# Altium project H-00488.PrjPcb (part 2 of 2)

## Sheet H-00488 - USB Hub.SchDoc: 7-Port USB Hub (USB2517)
size 403 x 281 mm; DocumentNumber: 7; SheetNumber: 7; SheetTotal: 12
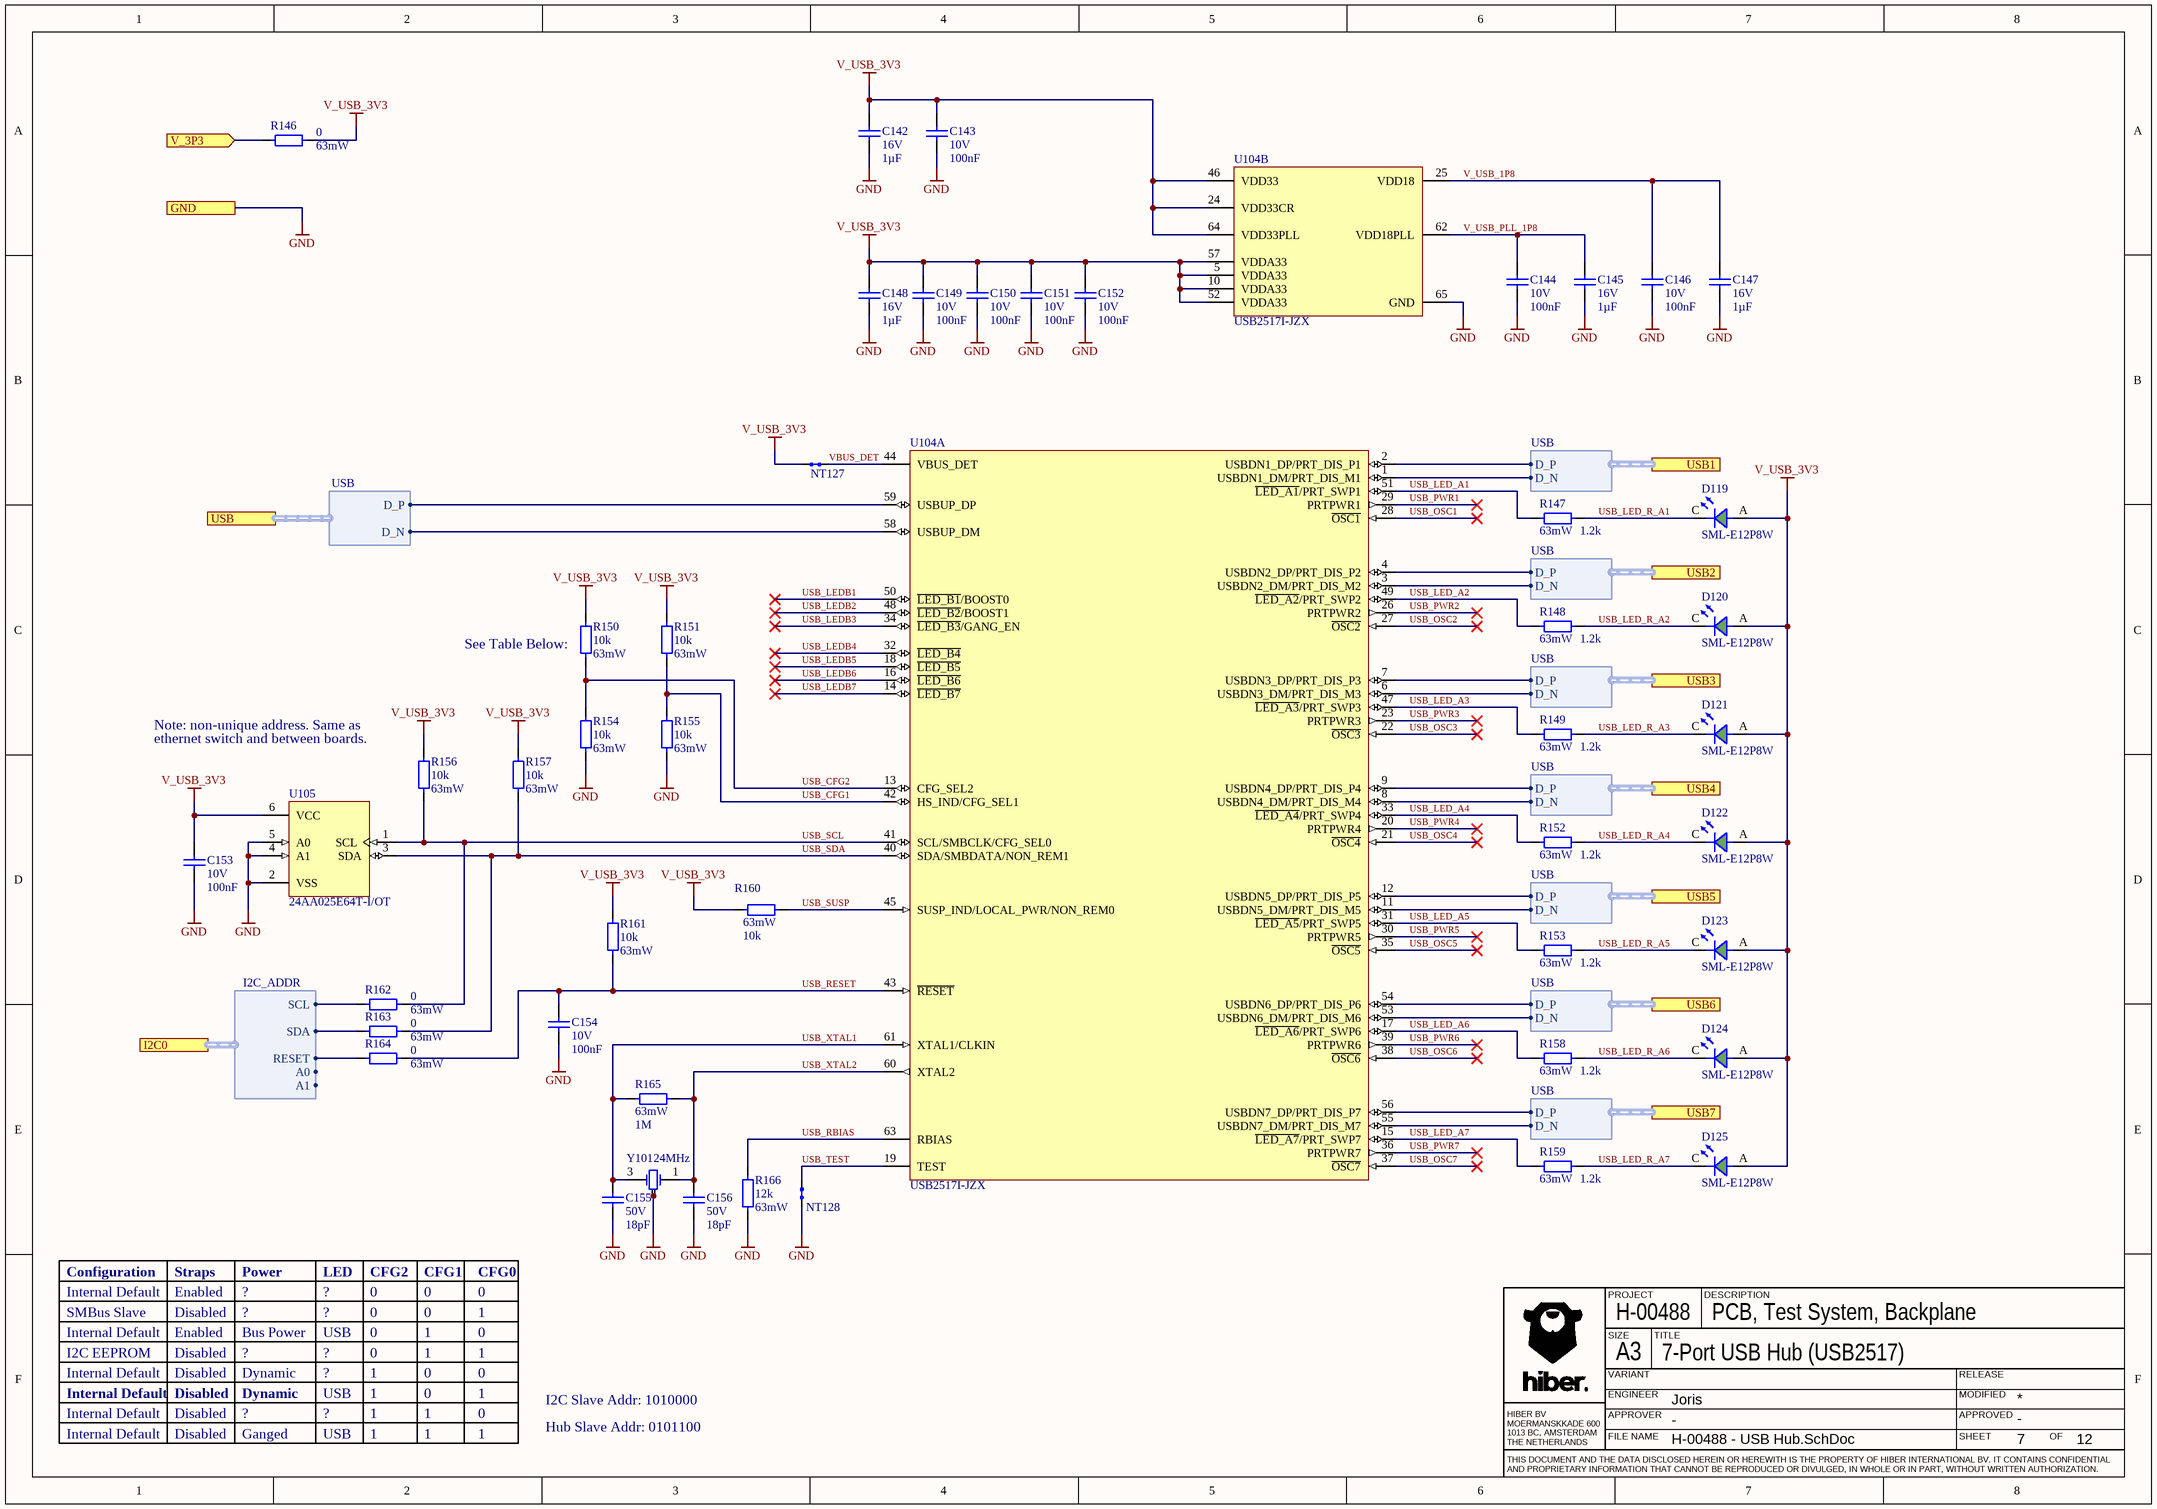
[diagram p4: H-00488 - USB Hub.SchDoc]

### Parts
C142  value 1µF  Rated Voltage: 16V  [CAPC100X50X55L30N]  (hidden comment: C0402C105K4PACTU)
C143  value 100nF  Rated Voltage: 10V  [CAPC100X50X55L30N]  (hidden comment: C0402C104K8RACTU)
C144  value 100nF  Rated Voltage: 10V  [CAPC100X50X55L30N]  (hidden comment: C0402C104K8RACTU)
C145  value 1µF  Rated Voltage: 16V  [CAPC100X50X55L30N]  (hidden comment: C0402C105K4PACTU)
C146  value 100nF  Rated Voltage: 10V  [CAPC100X50X55L30N]  (hidden comment: C0402C104K8RACTU)
C147  value 1µF  Rated Voltage: 16V  [CAPC100X50X55L30N]  (hidden comment: C0402C105K4PACTU)
C148  value 1µF  Rated Voltage: 16V  [CAPC100X50X55L30N]  (hidden comment: C0402C105K4PACTU)
C149  value 100nF  Rated Voltage: 10V  [CAPC100X50X55L30N]  (hidden comment: C0402C104K8RACTU)
C150  value 100nF  Rated Voltage: 10V  [CAPC100X50X55L30N]  (hidden comment: C0402C104K8RACTU)
C151  value 100nF  Rated Voltage: 10V  [CAPC100X50X55L30N]  (hidden comment: C0402C104K8RACTU)
C152  value 100nF  Rated Voltage: 10V  [CAPC100X50X55L30N]  (hidden comment: C0402C104K8RACTU)
C153  value 100nF  Rated Voltage: 10V  [CAPC100X50X55L30N]  (hidden comment: C0402C104K8RACTU)
C154  value 100nF  Rated Voltage: 10V  [CAPC100X50X55L30N]  (hidden comment: C0402C104K8RACTU)
C155  value 18pF  Rated Voltage: 50V  [CAPC100X50X55L30N]  (hidden comment: C0402C180J5GACTU)
C156  value 18pF  Rated Voltage: 50V  [CAPC100X50X55L30N]  (hidden comment: C0402C180J5GACTU)
D119  SML-E12P8W  [LEDC170X80X80L20_GREEN]
D120  SML-E12P8W  [LEDC170X80X80L20_GREEN]
D121  SML-E12P8W  [LEDC170X80X80L20_GREEN]
D122  SML-E12P8W  [LEDC170X80X80L20_GREEN]
D123  SML-E12P8W  [LEDC170X80X80L20_GREEN]
D124  SML-E12P8W  [LEDC170X80X80L20_GREEN]
D125  SML-E12P8W  [LEDC170X80X80L20_GREEN]
NT127  NET-TIE  [NT200]  (value not drawn)  (net tie, no BOM)
NT128  NET-TIE  [NT200]  (value not drawn)  (net tie, no BOM)
R146  value 0  Rated Power: 63mW  [RESC100X50X40L25N]  (hidden comment: CRCW04020000Z0ED)
R147  value 1.2k  Rated Power: 63mW  [RESC100X50X40L25N]  (hidden comment: CRCW04021K20FKED)
R148  value 1.2k  Rated Power: 63mW  [RESC100X50X40L25N]  (hidden comment: CRCW04021K20FKED)
R149  value 1.2k  Rated Power: 63mW  [RESC100X50X40L25N]  (hidden comment: CRCW04021K20FKED)
R150  value 10k  Rated Power: 63mW  [RESC100X50X40L25N]  (hidden comment: CRCW040210K0FKED)
R151  value 10k  Rated Power: 63mW  [RESC100X50X40L25N]  (hidden comment: CRCW040210K0FKED)
R152  value 1.2k  Rated Power: 63mW  [RESC100X50X40L25N]  (hidden comment: CRCW04021K20FKED)
R153  value 1.2k  Rated Power: 63mW  [RESC100X50X40L25N]  (hidden comment: CRCW04021K20FKED)
R154  value 10k  Rated Power: 63mW  [RESC100X50X40L25N]  (hidden comment: CRCW040210K0FKED)
R155  value 10k  Rated Power: 63mW  [RESC100X50X40L25N]  (hidden comment: CRCW040210K0FKED)
R156  value 10k  Rated Power: 63mW  [RESC100X50X40L25N]  (hidden comment: CRCW040210K0FKED)
R157  value 10k  Rated Power: 63mW  [RESC100X50X40L25N]  (hidden comment: CRCW040210K0FKED)
R158  value 1.2k  Rated Power: 63mW  [RESC100X50X40L25N]  (hidden comment: CRCW04021K20FKED)
R159  value 1.2k  Rated Power: 63mW  [RESC100X50X40L25N]  (hidden comment: CRCW04021K20FKED)
R160  value 10k  Rated Power: 63mW  [RESC100X50X40L25N]  (hidden comment: CRCW040210K0FKED)
R161  value 10k  Rated Power: 63mW  [RESC100X50X40L25N]  (hidden comment: CRCW040210K0FKED)
R162  value 0  Rated Power: 63mW  [RESC100X50X40L25N]  (hidden comment: CRCW04020000Z0ED)
R163  value 0  Rated Power: 63mW  [RESC100X50X40L25N]  (hidden comment: CRCW04020000Z0ED)
R164  value 0  Rated Power: 63mW  [RESC100X50X40L25N]  (hidden comment: CRCW04020000Z0ED)
R165  value 1M  Rated Power: 63mW  [RESC100X50X40L25N]  (hidden comment: CRCW04021M00FKED)
R166  value 12k  Rated Power: 63mW  [RESC100X50X40L25N]  (hidden comment: CRCW040212K0FKED)
U104  USB2517I-JZX  [QFN65P50_900X900X100L40X24T470N]  (parts A,B of 2)
U105  24AA025E64T-I/OT  [SOT23-6P95_270X145L35X35]
Y101  Frequency: 24MHz  [OSCCC320X250X60L90X110]  (hidden comment: TSX-322524.0000MF15X-AC3)

### Ports
GND, I2C0 (harness I2C_ADDR), USB1 (harness USB), USB2 (harness USB), USB3 (harness USB), USB4 (harness USB), USB5 (harness USB), USB6 (harness USB), USB7 (harness USB), USB (harness USB), V_3P3 (in)

### Harnesses
USB: D_P, D_N
I2C_ADDR: SDA, SCL, A0, A1, RESET

### Nets
GND: C142.1 C143.2 C144.2 C145.1 C146.2 C147.1 C148.1 C149.2 C150.2 C151.2 C152.2 C153.2 C154.2 C155.2 C156.2 NT128.2 R154.2 R155.2 R166.1 U104.65(GND) U105.2(VSS) U105.4(A1) U105.5(A0) Y101.2 Y101.4 ; port GND
V_USB_3V3: C142.2 C143.1 C148.2 C149.1 C150.1 C151.1 C152.1 C153.1 D119.A D120.A D121.A D122.A D123.A D124.A D125.A NT127.1 R146.2 R150.1 R151.1 R156.1 R157.1 R160.1 R161.1 U104.5(VDDA33) U104.10(VDDA33) U104.24(VDD33CR) U104.46(VDD33) U104.52(VDDA33) U104.57(VDDA33) U104.64(VDD33PLL) U105.6(VCC)
USB_CFG1: R151.2 R155.1 U104.42(HS_IND/CFG_SEL1)
USB_CFG2: R150.2 R154.1 U104.13(CFG_SEL2)
USB_LED_A1: R147.2 U104.51(~{LED_A1}/PRT_SWP1)
USB_LED_A2: R148.2 U104.49(~{LED_A2}/PRT_SWP2)
USB_LED_A3: R149.2 U104.47(~{LED_A3}/PRT_SWP3)
USB_LED_A4: R152.2 U104.33(~{LED_A4}/PRT_SWP4)
USB_LED_A5: R153.2 U104.31(~{LED_A5}/PRT_SWP5)
USB_LED_A6: R158.2 U104.17(~{LED_A6}/PRT_SWP6)
USB_LED_A7: R159.2 U104.15(~{LED_A7}/PRT_SWP7)
USB_LED_R_A1: D119.C R147.1
USB_LED_R_A2: D120.C R148.1
USB_LED_R_A3: D121.C R149.1
USB_LED_R_A4: D122.C R152.1
USB_LED_R_A5: D123.C R153.1
USB_LED_R_A6: D124.C R158.1
USB_LED_R_A7: D125.C R159.1
USB_LEDB1: U104.50(~{LED_B1}/BOOST0)
USB_LEDB2: U104.48(~{LED_B2}/BOOST1)
USB_LEDB3: U104.34(~{LED_B3}/GANG_EN)
USB_LEDB4: U104.32(~{LED_B4})
USB_LEDB5: U104.18(~{LED_B5})
USB_LEDB6: U104.16(~{LED_B6})
USB_LEDB7: U104.14(~{LED_B7})
USB_OSC1: U104.28(~{OSC1})
USB_OSC2: U104.27(~{OSC2})
USB_OSC3: U104.22(~{OSC3})
USB_OSC4: U104.21(~{OSC4})
USB_OSC5: U104.35(~{OSC5})
USB_OSC6: U104.38(~{OSC6})
USB_OSC7: U104.37(~{OSC7})
USB_PWR1: U104.29(PRTPWR1)
USB_PWR2: U104.26(PRTPWR2)
USB_PWR3: U104.23(PRTPWR3)
USB_PWR4: U104.20(PRTPWR4)
USB_PWR5: U104.30(PRTPWR5)
USB_PWR6: U104.39(PRTPWR6)
USB_PWR7: U104.36(PRTPWR7)
USB_RBIAS: R166.2 U104.63(RBIAS)
USB_RESET: C154.1 R161.2 R164.2 U104.43(~{RESET})
USB_SCL: R156.2 R162.2 U104.41(SCL/SMBCLK/CFG_SEL0) U105.1(SCL)
USB_SDA: R157.2 R163.1 U104.40(SDA/SMBDATA/NON_REM1) U105.3(SDA)
USB_SUSP: R160.2 U104.45(SUSP_IND/LOCAL_PWR/NON_REM0)
USB_TEST: NT128.1 U104.19(TEST)
USB_XTAL1: C155.1 R165.1 U104.61(XTAL1/CLKIN) Y101.3
USB_XTAL2: C156.1 R165.2 U104.60(XTAL2) Y101.1
V_USB_1P8: C146.1 C147.2 U104.25(VDD18)
V_USB_PLL_1P8: C144.1 C145.2 U104.62(VDD18PLL)
VBUS_DET: NT127.2 U104.44(VBUS_DET)
NetR146_1: R146.1 ; port V_3P3
NetR162_1: R162.1 ; port I2C0.SCL
NetR163_2: R163.2 ; port I2C0.SDA
NetR164_1: R164.1 ; port I2C0.RESET
NetU104_1: U104.1(USBDN1_DM/PRT_DIS_M1) ; port USB1.D_N
NetU104_2: U104.2(USBDN1_DP/PRT_DIS_P1) ; port USB1.D_P
NetU104_3: U104.3(USBDN2_DM/PRT_DIS_M2) ; port USB2.D_N
NetU104_4: U104.4(USBDN2_DP/PRT_DIS_P2) ; port USB2.D_P
NetU104_6: U104.6(USBDN3_DM/PRT_DIS_M3) ; port USB3.D_N
NetU104_7: U104.7(USBDN3_DP/PRT_DIS_P3) ; port USB3.D_P
NetU104_8: U104.8(USBDN4_DM/PRT_DIS_M4) ; port USB4.D_N
NetU104_9: U104.9(USBDN4_DP/PRT_DIS_P4) ; port USB4.D_P
NetU104_11: U104.11(USBDN5_DM/PRT_DIS_M5) ; port USB5.D_N
NetU104_12: U104.12(USBDN5_DP/PRT_DIS_P5) ; port USB5.D_P
NetU104_53: U104.53(USBDN6_DM/PRT_DIS_M6) ; port USB6.D_N
NetU104_54: U104.54(USBDN6_DP/PRT_DIS_P6) ; port USB6.D_P
NetU104_55: U104.55(USBDN7_DM/PRT_DIS_M7) ; port USB7.D_N
NetU104_56: U104.56(USBDN7_DP/PRT_DIS_P7) ; port USB7.D_P
NetU104_58: U104.58(USBUP_DM) ; port USB.D_N
NetU104_59: U104.59(USBUP_DP) ; port USB.D_P

### Notes on the sheet
- (near R150) See Table Below:
- (near R156) Note: non-unique address. Same as
- (near R156) ethernet switch and between boards.
- Configuration
- SMBus Slave
- Internal Default
- Straps
- Enabled
- Disabled
- Power
- ?
- LED
- CFG2
- 0
- CFG1
- CFG0
- 1
- I2C EEPROM
- Bus Power
- Dynamic
- USB
- Ganged
- Hub Slave Addr: 0101100
- I2C Slave Addr: 1010000
- PROJECT
- DESCRIPTION
- SIZE
- ENGINEER
- VARIANT
- A3
- TITLE
- MODIFIED
- RELEASE
- HIBER BV
  MOERMANSKKADE 600
  1013 BC, AMSTERDAM
  THE NETHERLANDS
- FILE NAME
- APPROVER
- SHEET
- APPROVED
- OF
- THIS DOCUMENT AND THE DATA DISCLOSED HEREIN OR HEREWITH IS THE PROPERTY OF HIBER INTERNATIONAL BV. IT CONTAINS CONFIDENTIAL AND PROPRIETARY INFORMATION THAT CANNOT BE REPRODUCED OR DIVULGED, IN WHOLE OR IN PART, WITHOUT WRITTEN AUTHORIZATION.

### Library data of the parts
C142 C145 C147 C148 = CMP-00827-3: CAP Standard 0402 (1005) 1,0uF 16V X5R (Standard); Tolerance: 10%; Type: Ceramic; Qualification: Standard; RoHS: Yes; Failure Rate: N/A; Termination Finish: 100% Matte Sn; Pins: 2; Dielectric: X5R; Mount: SMD; Case/Package: 0402 (1005)
C143 C144 C146 C149-C154 = CMP-00367-3: CAP Standard 0402 (1005) 100,0nF 10V X7R (Standard); Type: Ceramic; Tolerance: 10%; Termination Finish: 100% Matte Sn; Qualification: Standard; RoHS: Yes; Mount: SMT; Case/Package: 0402 (1005); Failure Rate: N/A; Pins: 2; Dielectric: X7R
C155 C156 = CMP-00401-3: CAP Standard 0402 (1005) 18,0pF 50V C0G (Standard); Type: Ceramic; Tolerance: 5%; Termination Finish: 100% Matte Sn; Qualification: Standard; RoHS: Yes; Mount: SMD; Case/Package: 0402 (1005); Failure Rate: N/A; Pins: 2; Dielectric: C0G
D119-D125 = CMP-00431-1: LED Green Diffused 0603 SMD; Dominant Wavelength: 630nm; Viewing Angle: 140°; Test Current: 20mA; Forward Voltage: 2,5V; Typical Wavelength: 560nm; Number of LEDs: 1; Lens Style: Clear, Colorless, Diffused, Rectangular; Luminous Intensity: 6.3mcd; Chip Structure: AlGaInP; Illumination Colour: Red; Lens Colour: White; Package Quantity: 1; Max Operating Temperature: 85°C; Width: 0.8mm; Case Code (Imperial): 0603; Length: 1.6mm; Lens Transparency: Diffused; Lead Free: Lead Free; Number of Pins: 2; Mount: Surface Mount; Height: 0.46mm; Color: Green; Case/Package: 0603; Forward Current: 20mA; Radiation Hardening: No; Min Operating Temperature: -40°C; Wavelength: 630nm; Case Code (Metric): 1608; Packaging: Tape and Reel
NT127 NT128 = CMP-00523-9: Net Tie, Inline
R146 R162-R164 = CMP-00197-9: RES Standard Thick Film 0402 0R00 ±1% 0,063W; Qualification: Automotive; Rated Voltage: 50V; Case/Package: 0402 (1005); Tolerance: 1%; Pins: 2; Termination Finish: Pure tin solder contacts on Ni barrier layer; Failure Rate: N/A; RoHS: Yes; Type: Standard Thick Film; Mount: Surface Mount
R147-R149 R152 R153 R158 R159 = CMP-00272-8: RES Standard Thick Film 0402 1K20 ±1% 0,063W; Qualification: Automotive; Rated Voltage: 50V; Mount: Surface Mount; Termination Finish: Pure tin solder contacts on Ni barrier layer; Case/Package: 0402 (1005); Pins: 2; Tolerance: 1%; Failure Rate: N/A; Type: Standard Thick Film; RoHS: Yes
R150 R151 R154-R157 R160 R161 = CMP-00294-7: RES Standard Thick Film 0402 10K0 ±1% 0,063W; Qualification: Automotive; Rated Voltage: 50V; Case/Package: 0402 (1005); Pins: 2; RoHS: Yes; Mount: Surface Mount; Tolerance: 1%; Termination Finish: Pure tin solder contacts on Ni barrier layer; Failure Rate: N/A; Type: Standard Thick Film
R165 = CMP-00342-7: RES Standard Thick Film 0402 1M00 ±1% 0,063W; Rated Voltage: 50V; Qualification: Automotive; Pins: 2; Mount: Surface Mount; Tolerance: 1%; Case/Package: 0402 (1005); Termination Finish: Pure tin solder contacts on Ni barrier layer; Failure Rate: N/A; RoHS: Yes; Type: Standard Thick Film
R166 = CMP-00296-7: RES Standard Thick Film 0402 12K0 ±1% 0,063W; Rated Voltage: 50V; Qualification: Automotive; Tolerance: 1%; Termination Finish: Pure tin solder contacts on Ni barrier layer; Pins: 2; RoHS: Yes; Mount: Surface Mount; Case/Package: 0402 (1005); Type: Standard Thick Film; Failure Rate: N/A
U104 = CMP-01073-9: USB Bus Controller, CMOS; Qualification Status: Not Qualified; Max Supply Voltage: 3.6V; Supply Voltage-Nom: 3.3V; Min Supply Voltage: 3V; Max Frequency: 24MHz; Package Shape: Square; Temperature Grade: INDUSTRIAL; Width: 9mm; Length: 9mm; Terminal Position: QUAD; Technology: CMOS; Min Operating Temperature: -40°C; Height - Seated (Max): 1mm; Package Code: HVQCCN; Package Style: CHIP CARRIER, HEAT SINK/SLUG, VERY THIN PROFILEMeter; Surface Mount: Yes; Number of Pins: 64; Terminal Form: No Lead; Terminal Pitch: 0.5mm; Max Operating Temperature: 85°C
U105 = CMP-01106-2: EEPROM, 256X8, Serial, CMOS, PDSO5; Time @ Peak Reflow Temperature-Max (s): 40s; Serial Bus Type: I2C; Terminal Finish: Tin; Peak Reflow Temperature (Cel): 260°C; Memory Type: EEPROM; Moisture Sensitivity Level: 1; JESD-609 Code: e3
Y101 = CMP-00387-3: Parallel - Fundamental Quartz Crystal, 24MHz Nom; Frequency Tolerance: 10ppm; ESR (Equivalent Series Resistance): 40R; Load Capacitance: 9pF; Frequency Stability: 15ppm; Qualification: Standard; Mount: Surface Mount; Package Quantity: 250; RoHS: Yes; Max Operating Temperature: 85°C; Packaging: Tape and Reel; Height: 0.024inch; Length: 0.126inch; Weight: 0.000564oz; Width: 0.098inch; Tolerance: 10ppm; Min Operating Temperature: -40°C; Lead Free: Lead Free; Termination: SMD/SMT; Case/Package: SMD/SMT

## Sheet H-00488 - Card Slot Master.SchDoc: Card Slot Master
size 403 x 281 mm; DocumentNumber: 9; SheetNumber: 9; SheetTotal: 12
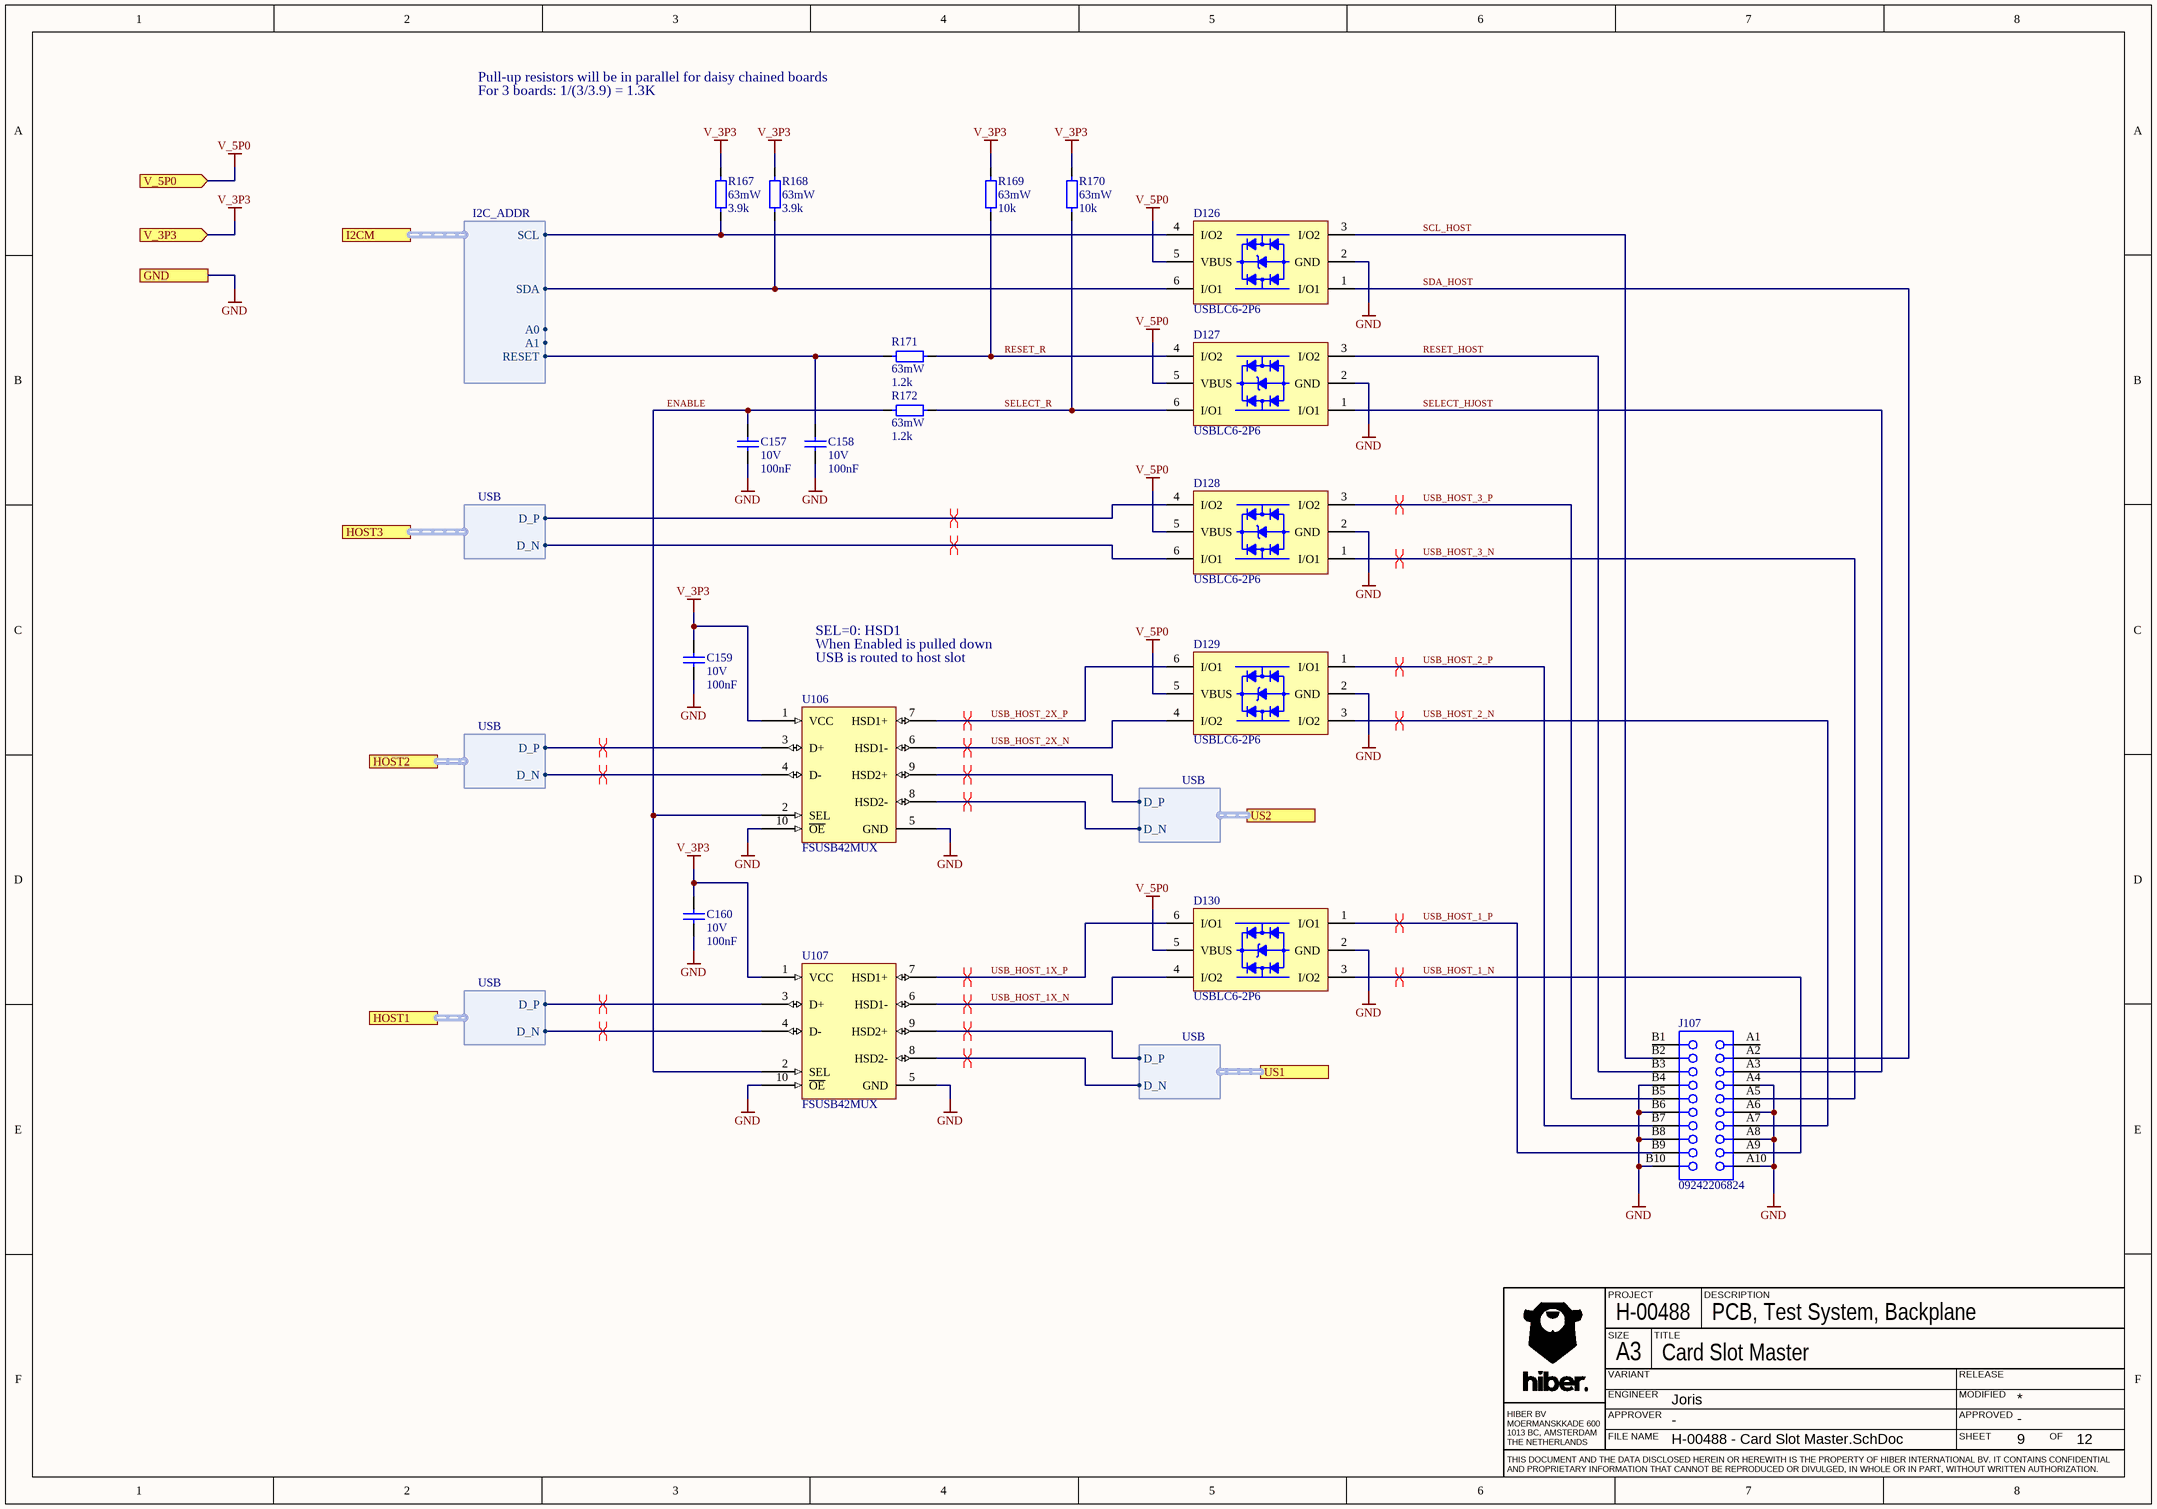
[diagram p5: H-00488 - Card Slot Master.SchDoc]

### Parts
C157  value 100nF  Rated Voltage: 10V  [CAPC100X50X55L30N]  (hidden comment: C0402C104K8RACTU)
C158  value 100nF  Rated Voltage: 10V  [CAPC100X50X55L30N]  (hidden comment: C0402C104K8RACTU)
C159  value 100nF  Rated Voltage: 10V  [CAPC100X50X55L30N]  (hidden comment: C0402C104K8RACTU)
C160  value 100nF  Rated Voltage: 10V  [CAPC100X50X55L30N]  (hidden comment: C0402C104K8RACTU)
D126  USBLC6-2P6  [DIOSOFL6P50_160X160X95L29X26]
D127  USBLC6-2P6  [DIOSOFL6P50_160X160X95L29X26]
D128  USBLC6-2P6  [DIOSOFL6P50_160X160X95L29X26]
D129  USBLC6-2P6  [DIOSOFL6P50_160X160X95L29X26]
D130  USBLC6-2P6  [DIOSOFL6P50_160X160X95L29X26]
J107  09242206824  [HARTING_09242206824]
R167  value 3.9k  Rated Power: 63mW  [RESC100X50X40L25N]  (hidden comment: CRCW04023K90FKED)
R168  value 3.9k  Rated Power: 63mW  [RESC100X50X40L25N]  (hidden comment: CRCW04023K90FKED)
R169  value 10k  Rated Power: 63mW  [RESC100X50X40L25N]  (hidden comment: CRCW040210K0FKED)
R170  value 10k  Rated Power: 63mW  [RESC100X50X40L25N]  (hidden comment: CRCW040210K0FKED)
R171  value 1.2k  Rated Power: 63mW  [RESC100X50X40L25N]  (hidden comment: CRCW04021K20FKED)
R172  value 1.2k  Rated Power: 63mW  [RESC100X50X40L25N]  (hidden comment: CRCW04021K20FKED)
U106  FSUSB42MUX  [SOP10P50_300X490X110L55X25]
U107  FSUSB42MUX  [SOP10P50_300X490X110L55X25]

### Ports
GND, HOST1 (harness USB), HOST2 (harness USB), HOST3 (harness USB), I2CM (harness I2C_ADDR), US1 (harness USB), US2 (harness USB), V_3P3 (in), V_5P0 (in)

### Harnesses
USB: D_P, D_N
I2C_ADDR: SDA, SCL, A0, A1, RESET

### Nets
GND: C157.2 C158.2 C159.2 C160.2 D126.2(GND) D127.2(GND) D128.2(GND) D129.2(GND) D130.2(GND) J107.A4 J107.A6 J107.A8 J107.A10 J107.B4 J107.B6 J107.B8 J107.B10 U106.5(GND) U106.10(~{OE}) U107.5(GND) U107.10(~{OE}) ; port GND
V_3P3: C159.1 C160.1 R167.2 R168.2 R169.2 R170.2 U106.1(VCC) U107.1(VCC) ; port V_3P3
V_5P0: D126.5(VBUS) D127.5(VBUS) D128.5(VBUS) D129.5(VBUS) D130.5(VBUS) ; port V_5P0
ENABLE: C157.1 R172.2 U106.2(SEL) U107.2(SEL)
RESET_HOST: D127.3(I/O2) J107.B3
RESET_R: D127.4(I/O2) R169.1 R171.1
SCL_HOST: D126.3(I/O2) J107.B2
SDA_HOST: D126.1(I/O1) J107.A2
SELECT_HJOST: D127.1(I/O1) J107.A3
SELECT_R: D127.6(I/O1) R170.1 R172.1
USB_HOST_1_N: D130.3(I/O2) J107.A9
USB_HOST_1_P: D130.1(I/O1) J107.B9
USB_HOST_1X_N: D130.4(I/O2) U107.6(HSD1-)
USB_HOST_1X_P: D130.6(I/O1) U107.7(HSD1+)
USB_HOST_2_N: D129.3(I/O2) J107.A7
USB_HOST_2_P: D129.1(I/O1) J107.B7
USB_HOST_2X_N: D129.4(I/O2) U106.6(HSD1-)
USB_HOST_2X_P: D129.6(I/O1) U106.7(HSD1+)
USB_HOST_3_N: D128.1(I/O1) J107.A5
USB_HOST_3_P: D128.3(I/O2) J107.B5
NetC158_1: C158.1 R171.2 ; port I2CM.RESET
NetD126_4: D126.4(I/O2) R167.1 ; port I2CM.SCL
NetD126_6: D126.6(I/O1) R168.1 ; port I2CM.SDA
NetD128_4: D128.4(I/O2) ; port HOST3.D_P
NetD128_6: D128.6(I/O1) ; port HOST3.D_N
NetU106_3: U106.3(D+) ; port HOST2.D_P
NetU106_4: U106.4(D-) ; port HOST2.D_N
NetU106_8: U106.8(HSD2-) ; port US2.D_N
NetU106_9: U106.9(HSD2+) ; port US2.D_P
NetU107_3: U107.3(D+) ; port HOST1.D_P
NetU107_4: U107.4(D-) ; port HOST1.D_N
NetU107_8: U107.8(HSD2-) ; port US1.D_N
NetU107_9: U107.9(HSD2+) ; port US1.D_P

Not connected (* = marked no-connect by the designer): J107 A1 B1

### Layout directives
differential pair: NetD128_4, NetD128_6, NetU106_3, NetU106_4, NetU106_8, NetU106_9, NetU107_3, NetU107_4, NetU107_8, NetU107_9, USB_HOST_1_N, USB_HOST_1_P, USB_HOST_1X_N, USB_HOST_1X_P, USB_HOST_2_N, USB_HOST_2_P, USB_HOST_2X_N, USB_HOST_2X_P, USB_HOST_3_N, USB_HOST_3_P

### Notes on the sheet
- Pull-up resistors will be in parallel for daisy chained boards
- For 3 boards: 1/(3/3.9) = 1.3K
- SEL=0: HSD1
- When Enabled is pulled down
- USB is routed to host slot
- PROJECT
- DESCRIPTION
- SIZE
- ENGINEER
- VARIANT
- A3
- TITLE
- MODIFIED
- RELEASE
- HIBER BV
  MOERMANSKKADE 600
  1013 BC, AMSTERDAM
  THE NETHERLANDS
- FILE NAME
- APPROVER
- SHEET
- APPROVED
- OF
- THIS DOCUMENT AND THE DATA DISCLOSED HEREIN OR HEREWITH IS THE PROPERTY OF HIBER INTERNATIONAL BV. IT CONTAINS CONFIDENTIAL AND PROPRIETARY INFORMATION THAT CANNOT BE REPRODUCED OR DIVULGED, IN WHOLE OR IN PART, WITHOUT WRITTEN AUTHORIZATION.

### Library data of the parts
C157-C160 = CMP-00367-3: as C143 on sheet H-00488 - USB Hub; Termination Finish: 100% Matte Sn; Qualification: Standard; RoHS: Yes; Mount: SMT; Case/Package: 0402 (1005); Failure Rate: N/A; Pins: 2; Dielectric: X7R
D126-D130 = CMP-00780-2: TVS DIODE 5.25VWM 17VC SOT666; Reverse Breakdown Voltage: 6V; ESD Protection: Yes; Max Reverse Leakage Current: 150nA; Number of Elements: 1; Clamping Voltage: 17V; Direction: Bidirectional, Unidirectional; Capacitance: 3.5pF; Working Voltage: 5V; Number of Channels: 2; Test Current: 1mA; Peak Pulse Current: 5A; Element Configuration: Dual; Qualification: Standard; Max Operating Temperature: 125°C; Lead Free: Lead Free; Contact Plating: Matte, Tin; Package Quantity: 1; Case/Package: SOT-666; Min Operating Temperature: -40°C; Length: 1.7mm; Breakdown Voltage: 6V; Packaging: Tape and Reel; REACH SVHC: No SVHC; Termination: SMD/SMT; Mount: Surface Mount; Power Line Protection: Yes; Radiation Hardening: No; RoHS: Yes; Leakage Current: 150nA; Polarity: Bidirectional, Unidirectional; Depth: 1.3mm; Number of Bidirectional Channels: 2; Number of Pins: 6; Height: 0.6mm; Reverse Standoff Voltage: 5V; Width: 1.3mm; Min Breakdown Voltage: 6V; Operating Supply Voltage: 5V; Max Breakdown Voltage: 6V
J107 = CMP-01077-1: Board Euro Connector; RoHS: Yes; Mount: TH; Connector Type: BOARD EURO CONNECTOR
R167 R168 = CMP-00284-8: RES Standard Thick Film 0402 3K90 ±1% 0,063W; Qualification: Automotive; Rated Voltage: 50V; Mount: Surface Mount; Termination Finish: Pure tin solder contacts on Ni barrier layer; Tolerance: 1%; Type: Standard Thick Film; Case/Package: 0402 (1005); Failure Rate: N/A; Pins: 2; RoHS: Yes
R169 R170 = CMP-00294-7: as R150 on sheet H-00488 - USB Hub; Mount: Surface Mount; Termination Finish: Pure tin solder contacts on Ni barrier layer; Tolerance: 1%; Type: Standard Thick Film; Case/Package: 0402 (1005); Failure Rate: N/A; Pins: 2; RoHS: Yes
R171 R172 = CMP-00272-8: as R147 on sheet H-00488 - USB Hub; Mount: Surface Mount; Termination Finish: Pure tin solder contacts on Ni barrier layer; Tolerance: 1%; Type: Standard Thick Film; Case/Package: 0402 (1005); Failure Rate: N/A; Pins: 2; RoHS: Yes
U106 U107 = CMP-00416-7: IC USB SWITCH DPDT 10MSOP; Min Supply Voltage: 3V; Supply Type: Single; Current: 100mA; Operating Supply Voltage: 4.3V; Data Rate: 480Mbps; Number of Outputs: 4; Number of Channels: 2; On-State Resistance: 6.5R; Length: 3mm; REACH SVHC: No SVHC; Radiation Hardening: No; Throw Configuration: DPDT; Width: 3mm; Mount: Surface Mount; Weight: 0.1125g; Min Operating Temperature: -40°C; Packaging: Tape and Reel; Max Supply Voltage: 4.3V; Voltage: 4.3V; Number of Pins: 10; Package Quantity: 1; Max Operating Temperature: 85°C; Height: 0.85mm; Lead Free: Lead Free; Number of Inputs: 2; Case/Package: MSOP

## Sheet H-00488 - Connectors Upstream.SchDoc: Connectors Upstream
size 403 x 281 mm; DocumentNumber: 11; SheetNumber: 11; SheetTotal: 12
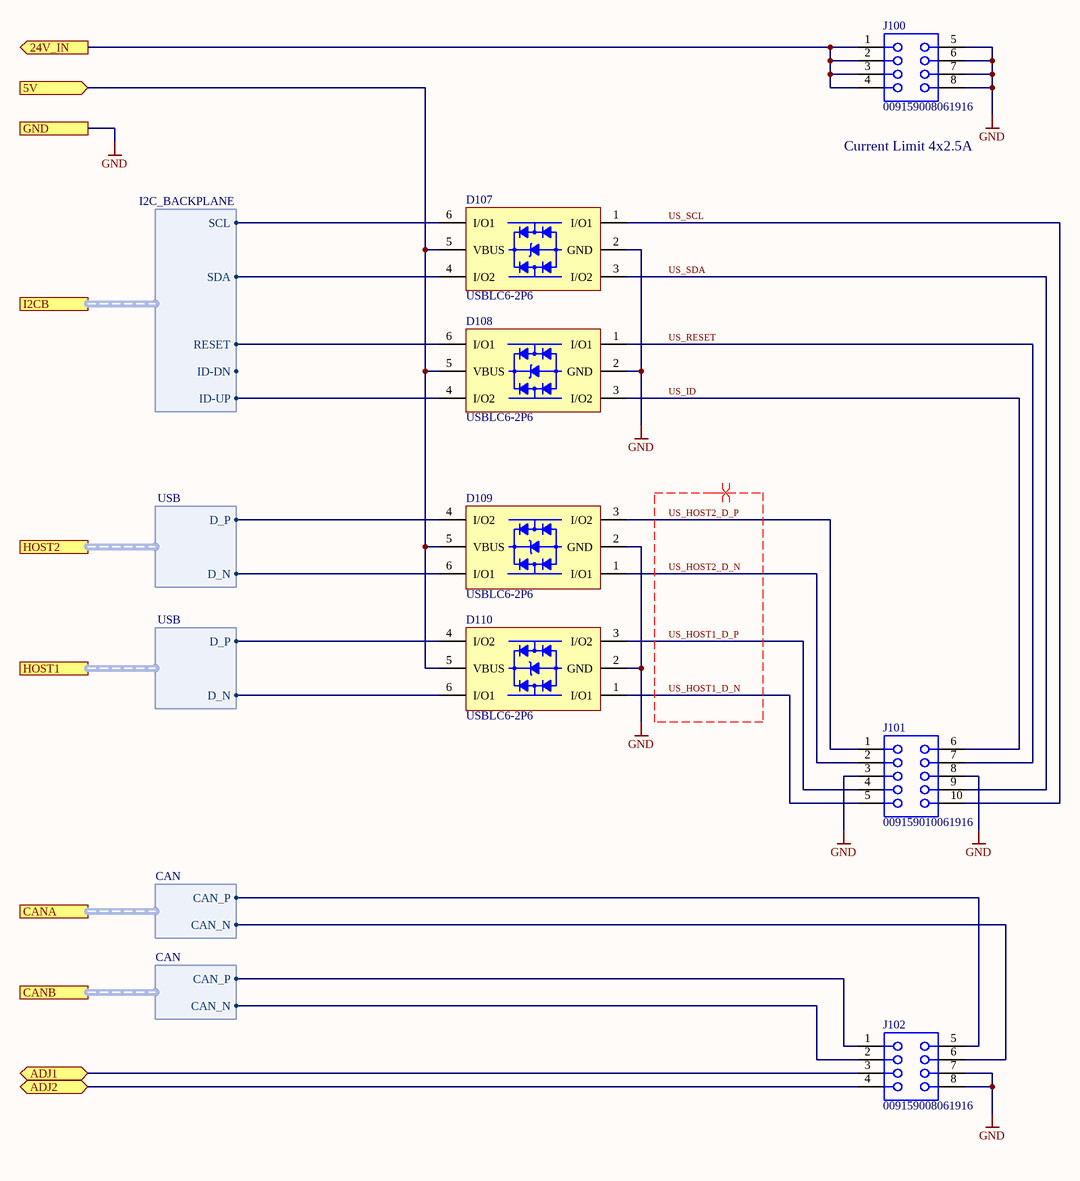
[diagram p6: H-00488 - Connectors Upstream.SchDoc]

### Parts
D107  USBLC6-2P6  [DIOSOFL6P50_160X160X95L29X26]
D108  USBLC6-2P6  [DIOSOFL6P50_160X160X95L29X26]
D109  USBLC6-2P6  [DIOSOFL6P50_160X160X95L29X26]
D110  USBLC6-2P6  [DIOSOFL6P50_160X160X95L29X26]
J100  009159008061916  [AVX_00-9159-008]
J101  009159010061916  [AVX_00-9159-010]
J102  009159008061916  [AVX_00-9159-008]

### Ports
5V (in), 24V_IN (out), ADJ1 (bidir), ADJ2 (bidir), CANA (harness CAN), CANB (harness CAN), GND, HOST1 (harness USB), HOST2 (harness USB), I2CB (harness I2C_BACKPLANE)

### Harnesses
I2C_BACKPLANE: SDA, SCL, ID-UP, RESET, ID-DN
USB: D_P, D_N
CAN: CAN_N, CAN_P

### Nets
GND: D107.2(GND) D108.2(GND) D109.2(GND) D110.2(GND) J100.5 J100.6 J100.7 J100.8 J101.3 J101.8 J102.7 J102.8 ; port GND
US_HOST1_D_N: D110.1(I/O1) J101.5
US_HOST1_D_P: D110.3(I/O2) J101.4
US_HOST2_D_N: D109.1(I/O1) J101.2
US_HOST2_D_P: D109.3(I/O2) J101.1
US_ID: D108.3(I/O2) J101.6
US_RESET: D108.1(I/O1) J101.7
US_SCL: D107.1(I/O1) J101.10
US_SDA: D107.3(I/O2) J101.9
NetD107_4: D107.4(I/O2) ; port I2CB.SDA
NetD107_5: D107.5(VBUS) D108.5(VBUS) D109.5(VBUS) D110.5(VBUS) ; port 5V
NetD107_6: D107.6(I/O1) ; port I2CB.SCL
NetD108_4: D108.4(I/O2) ; port I2CB.ID-UP
NetD108_6: D108.6(I/O1) ; port I2CB.RESET
NetD109_4: D109.4(I/O2) ; port HOST2.D_P
NetD109_6: D109.6(I/O1) ; port HOST2.D_N
NetD110_4: D110.4(I/O2) ; port HOST1.D_P
NetD110_6: D110.6(I/O1) ; port HOST1.D_N
NetJ100_1: J100.1 J100.2 J100.3 J100.4 ; port 24V_IN
NetJ102_1: J102.1 ; port CANB.CAN_P
NetJ102_2: J102.2 ; port CANB.CAN_N
NetJ102_3: J102.3 ; port ADJ1
NetJ102_4: J102.4 ; port ADJ2
NetJ102_5: J102.5 ; port CANA.CAN_P
NetJ102_6: J102.6 ; port CANA.CAN_N

### Layout directives
differential pair; differential pair class DIFF_USB_EXT: US_HOST1_D_N, US_HOST1_D_P, US_HOST2_D_N, US_HOST2_D_P

### Notes on the sheet
- (near J100) Current Limit 4x2.5A
- PROJECT
- DESCRIPTION
- SIZE
- ENGINEER
- VARIANT
- A3
- TITLE
- MODIFIED
- RELEASE
- HIBER BV
  MOERMANSKKADE 600
  1013 BC, AMSTERDAM
  THE NETHERLANDS
- FILE NAME
- APPROVER
- SHEET
- APPROVED
- OF
- THIS DOCUMENT AND THE DATA DISCLOSED HEREIN OR HEREWITH IS THE PROPERTY OF HIBER INTERNATIONAL BV. IT CONTAINS CONFIDENTIAL AND PROPRIETARY INFORMATION THAT CANNOT BE REPRODUCED OR DIVULGED, IN WHOLE OR IN PART, WITHOUT WRITTEN AUTHORIZATION.

### Library data of the parts
D107-D110 = CMP-00780-2: TVS DIODE 5.25VWM 17VC SOT666; Reverse Breakdown Voltage: 6V; ESD Protection: Yes; Max Reverse Leakage Current: 150nA; Number of Elements: 1; Clamping Voltage: 17V; Direction: Bidirectional, Unidirectional; Capacitance: 3.5pF; Working Voltage: 5V; Number of Channels: 2; Test Current: 1mA; Peak Pulse Current: 5A; Element Configuration: Dual; Qualification: Standard; Max Operating Temperature: 125°C; Lead Free: Lead Free; Contact Plating: Matte, Tin; Package Quantity: 1; Case/Package: SOT-666; Min Operating Temperature: -40°C; Length: 1.7mm; Breakdown Voltage: 6V; Packaging: Tape and Reel; REACH SVHC: No SVHC; Termination: SMD/SMT; Mount: Surface Mount; Power Line Protection: Yes; Radiation Hardening: No; RoHS: Yes; Leakage Current: 150nA; Polarity: Bidirectional, Unidirectional; Depth: 1.3mm; Number of Bidirectional Channels: 2; Number of Pins: 6; Height: 0.6mm; Reverse Standoff Voltage: 5V; Width: 1.3mm; Min Breakdown Voltage: 6V; Operating Supply Voltage: 5V; Max Breakdown Voltage: 6V
J100 J102 = CMP-01083-5: CONN SSL BRIDGE 8POS 2MM; RoHS: Yes; Mount: TH
J101 = CMP-01075-4: AVX INTERCONNECT - 009159010061916 - CARD EDGE CONN, DUAL SIDE, 10POS, SMD; RoHS: Yes; Mount: TH

## Sheet H-00488 - Connectors Downstream.SchDoc: Connectors Downstream
size 403 x 281 mm; DocumentNumber: 12; SheetNumber: 12; SheetTotal: 12
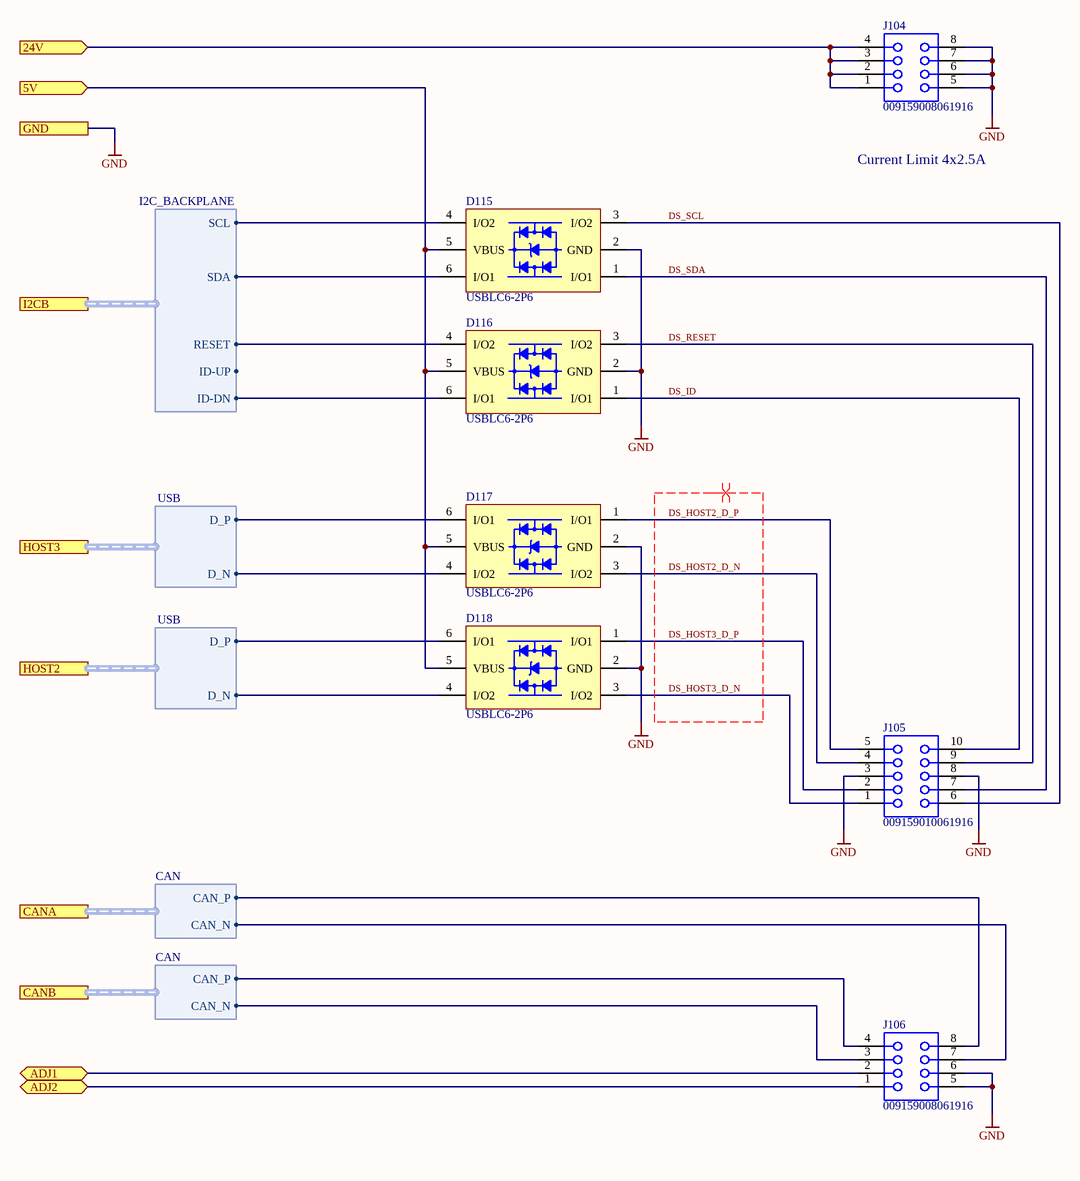
[diagram p7: H-00488 - Connectors Downstream.SchDoc]

### Parts
D115  USBLC6-2P6  [DIOSOFL6P50_160X160X95L29X26]
D116  USBLC6-2P6  [DIOSOFL6P50_160X160X95L29X26]
D117  USBLC6-2P6  [DIOSOFL6P50_160X160X95L29X26]
D118  USBLC6-2P6  [DIOSOFL6P50_160X160X95L29X26]
J104  009159008061916  [AVX_00-9159-008]
J105  009159010061916  [AVX_00-9159-010]
J106  009159008061916  [AVX_00-9159-008]

### Ports
5V (in), 24V (in), ADJ1 (bidir), ADJ2 (bidir), CANA (harness CAN), CANB (harness CAN), GND, HOST2 (harness USB), HOST3 (harness USB), I2CB (harness I2C_BACKPLANE)

### Harnesses
I2C_BACKPLANE: SDA, SCL, ID-UP, RESET, ID-DN
USB: D_P, D_N
CAN: CAN_N, CAN_P

### Nets
GND: D115.2(GND) D116.2(GND) D117.2(GND) D118.2(GND) J104.5 J104.6 J104.7 J104.8 J105.3 J105.8 J106.5 J106.6 ; port GND
DS_HOST2_D_N: D117.3(I/O2) J105.4
DS_HOST2_D_P: D117.1(I/O1) J105.5
DS_HOST3_D_N: D118.3(I/O2) J105.1
DS_HOST3_D_P: D118.1(I/O1) J105.2
DS_ID: D116.1(I/O1) J105.10
DS_RESET: D116.3(I/O2) J105.9
DS_SCL: D115.3(I/O2) J105.6
DS_SDA: D115.1(I/O1) J105.7
NetD115_4: D115.4(I/O2) ; port I2CB.SCL
NetD115_5: D115.5(VBUS) D116.5(VBUS) D117.5(VBUS) D118.5(VBUS) ; port 5V
NetD115_6: D115.6(I/O1) ; port I2CB.SDA
NetD116_4: D116.4(I/O2) ; port I2CB.RESET
NetD116_6: D116.6(I/O1) ; port I2CB.ID-DN
NetD117_4: D117.4(I/O2) ; port HOST3.D_N
NetD117_6: D117.6(I/O1) ; port HOST3.D_P
NetD118_4: D118.4(I/O2) ; port HOST2.D_N
NetD118_6: D118.6(I/O1) ; port HOST2.D_P
NetJ104_1: J104.1 J104.2 J104.3 J104.4 ; port 24V
NetJ106_1: J106.1 ; port ADJ2
NetJ106_2: J106.2 ; port ADJ1
NetJ106_3: J106.3 ; port CANB.CAN_N
NetJ106_4: J106.4 ; port CANB.CAN_P
NetJ106_7: J106.7 ; port CANA.CAN_N
NetJ106_8: J106.8 ; port CANA.CAN_P

### Layout directives
differential pair; differential pair class DIFF_USB_EXT: DS_HOST2_D_N, DS_HOST2_D_P, DS_HOST3_D_N, DS_HOST3_D_P

### Notes on the sheet
- Current Limit 4x2.5A
- PROJECT
- DESCRIPTION
- SIZE
- ENGINEER
- VARIANT
- A3
- TITLE
- MODIFIED
- RELEASE
- HIBER BV
  MOERMANSKKADE 600
  1013 BC, AMSTERDAM
  THE NETHERLANDS
- FILE NAME
- APPROVER
- SHEET
- APPROVED
- OF
- THIS DOCUMENT AND THE DATA DISCLOSED HEREIN OR HEREWITH IS THE PROPERTY OF HIBER INTERNATIONAL BV. IT CONTAINS CONFIDENTIAL AND PROPRIETARY INFORMATION THAT CANNOT BE REPRODUCED OR DIVULGED, IN WHOLE OR IN PART, WITHOUT WRITTEN AUTHORIZATION.

### Library data of the parts
D115-D118 = CMP-00780-2: as D107-D110 on sheet H-00488 - Connectors Upstream; Max Operating Temperature: 125°C; Lead Free: Lead Free; Contact Plating: Matte, Tin; Package Quantity: 1; Case/Package: SOT-666; Min Operating Temperature: -40°C; Length: 1.7mm; Breakdown Voltage: 6V; Packaging: Tape and Reel; REACH SVHC: No SVHC; Termination: SMD/SMT; Mount: Surface Mount; Power Line Protection: Yes; Radiation Hardening: No; RoHS: Yes; Leakage Current: 150nA; Polarity: Bidirectional, Unidirectional; Depth: 1.3mm; Number of Bidirectional Channels: 2; Number of Pins: 6; Height: 0.6mm; Reverse Standoff Voltage: 5V; Width: 1.3mm; Min Breakdown Voltage: 6V; Operating Supply Voltage: 5V; Max Breakdown Voltage: 6V
J104 J106 = CMP-01083-5: CONN SSL BRIDGE 8POS 2MM; RoHS: Yes; Mount: TH
J105 = CMP-01075-4: as J101 on sheet H-00488 - Connectors Upstream; RoHS: Yes; Mount: TH

## Assembly variants
01: not fitted J100 J101 J102 J104 J105 J106 R103 R131 R132 R133 R151 R154 R162 R163 R164; alternate parts R8_1 -> CMP-00544-3